# EAGLE design Arduino-Ethernet-Shield2-V2 (EAGLE 6.4)
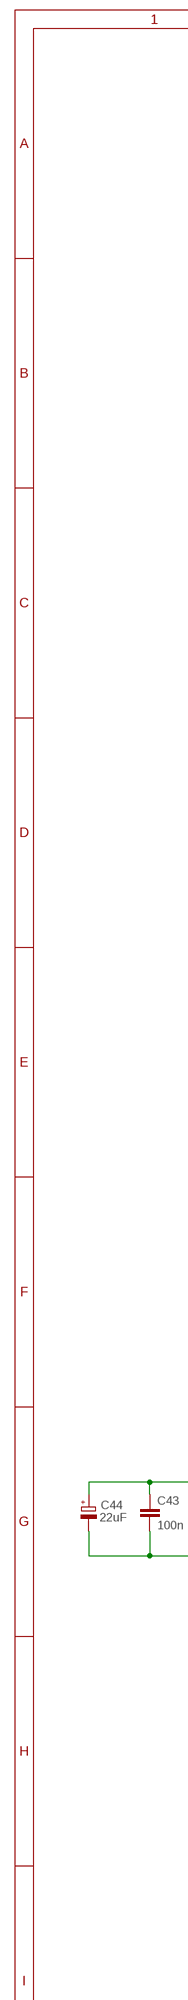
[diagram p0: schematic, sheet 1, part 1 of 2]
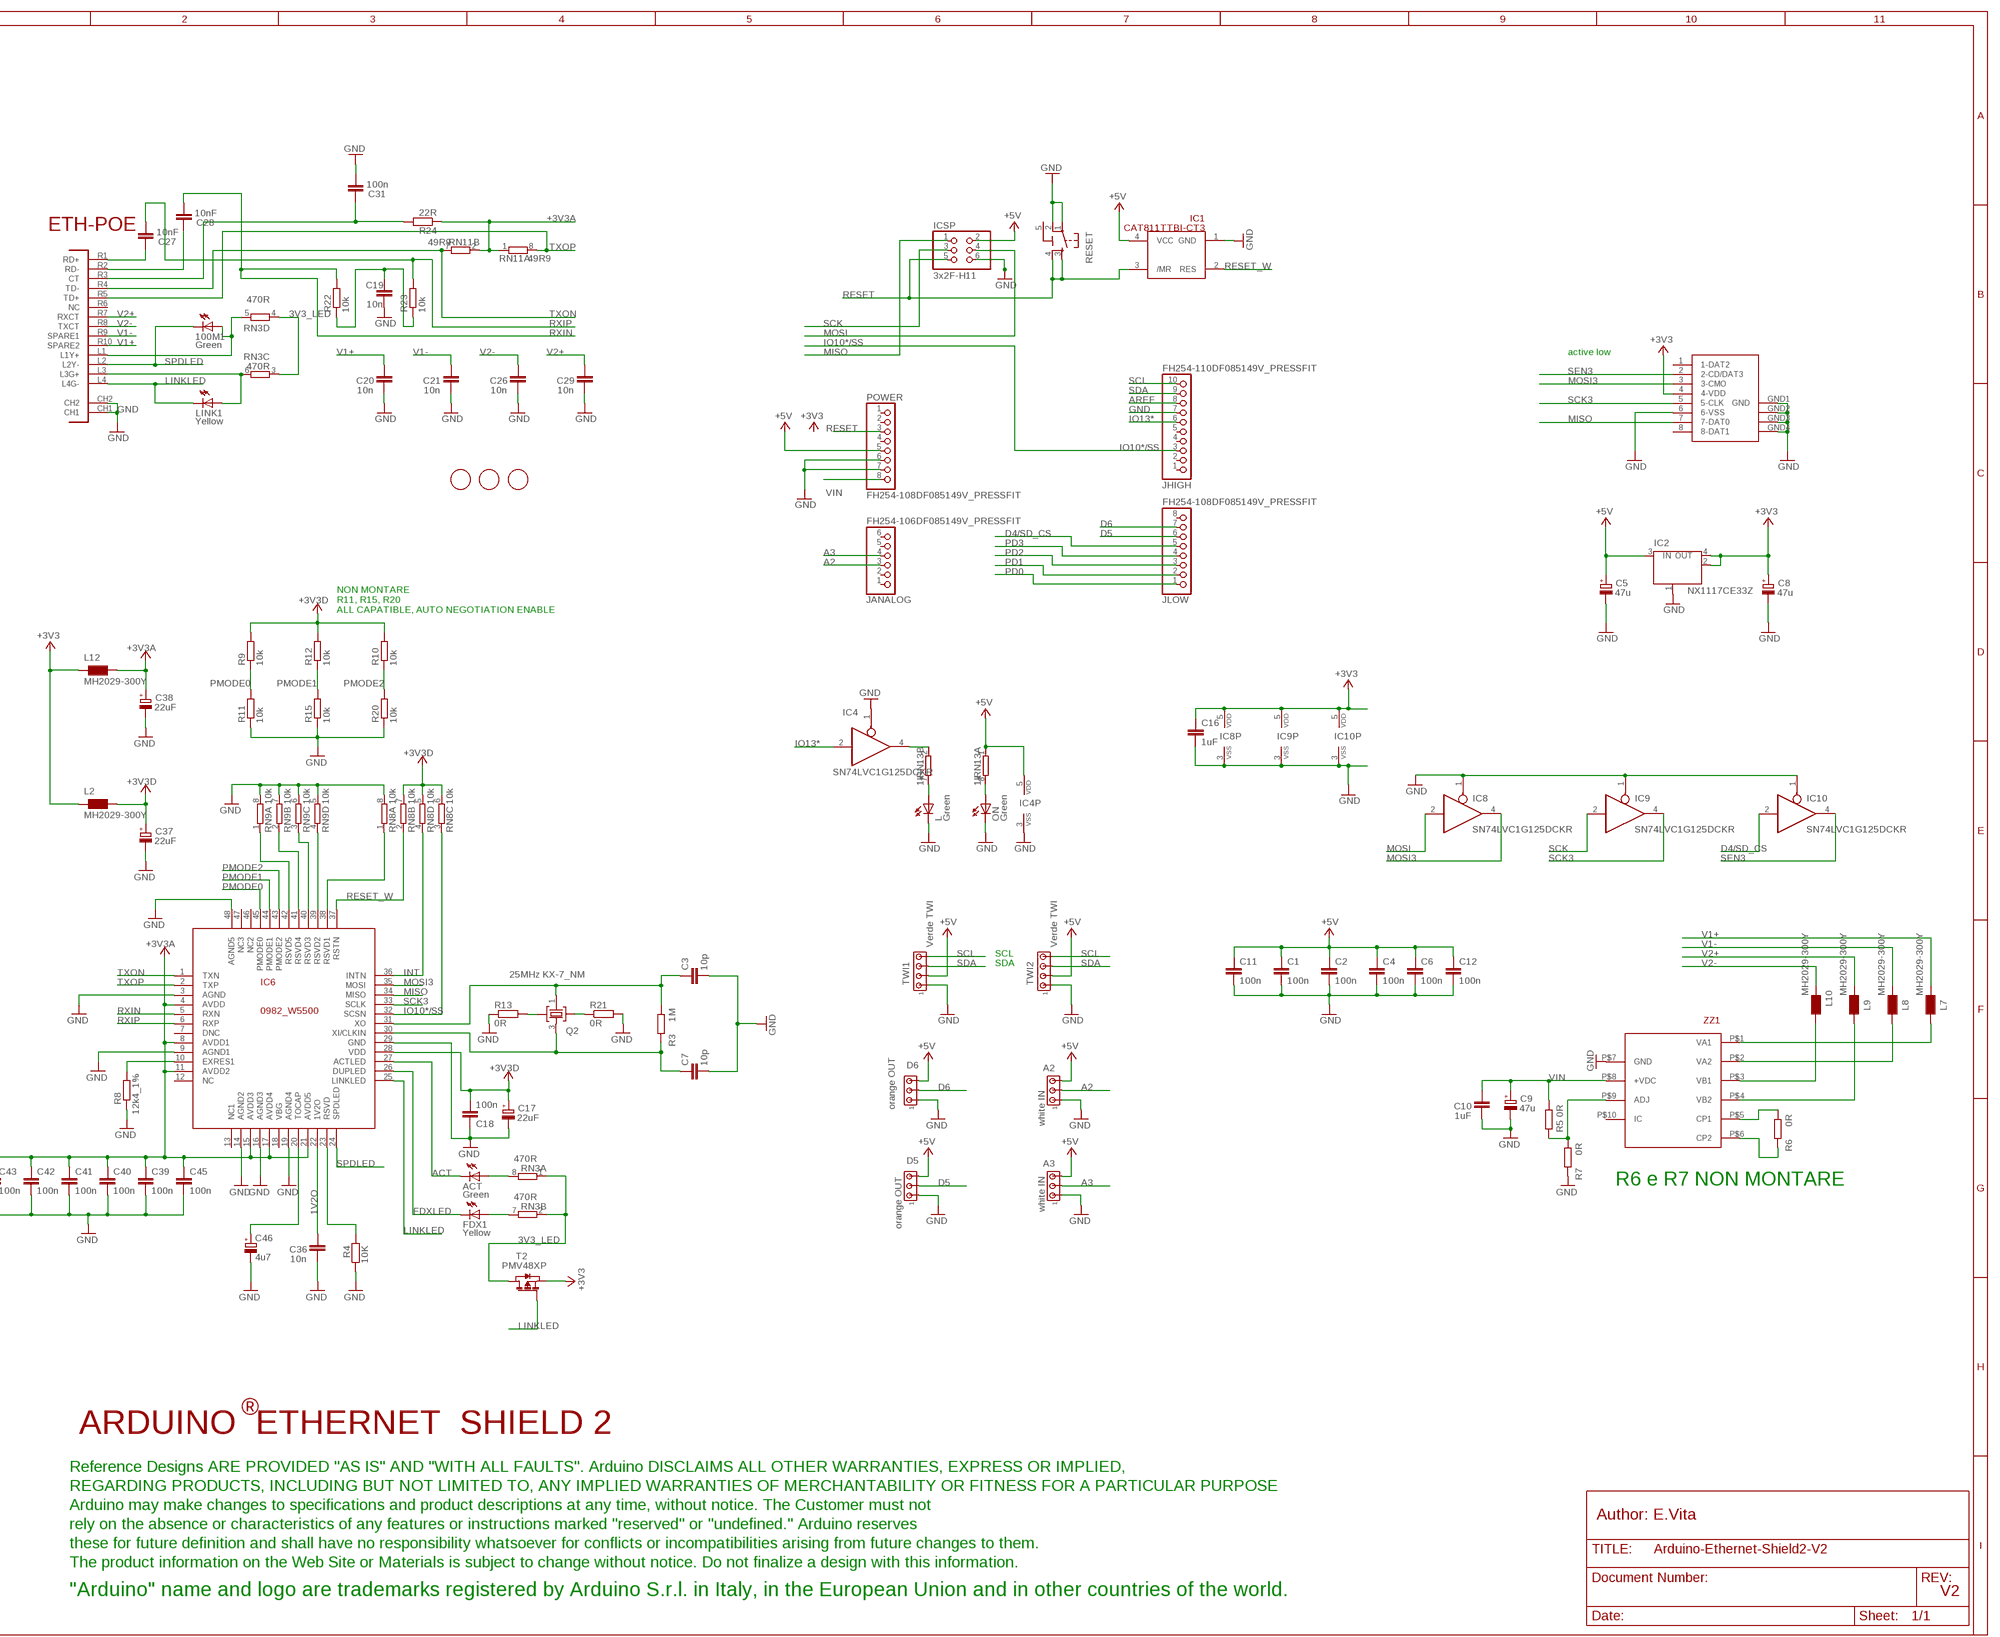
[diagram p1: schematic, sheet 1, part 2 of 2]

## Parts
100M1  Green  0043_KPT-2012SGC  [CHIPLED_0805]
A2  white IN  1695_WA254-03S-IN  [10X03MTA]
A3  white IN  1695_WA254-03S-IN  [10X03MTA]
ACT  Green  0043_KPT-2012SGC  [CHIPLED_0805]
C1  100n  0015_100NF_0603  [C0603-ROUND]
C2  100n  0015_100NF_0603  [C0603-ROUND]
C3  10p  0245_0603C0G10PF50V  [C0603-ROUND]
C4  100n  0015_100NF_0603  [C0603-ROUND]
C5  47u  0113_47UF  [PANASONIC_D]
C6  100n  0015_100NF_0603  [C0603-ROUND]
C7  10p  0245_0603C0G10PF50V  [C0603-ROUND]
C8  47u  0113_47UF  [PANASONIC_D]
C9  47u  0113_47UF  [PANASONIC_D]
C10  1uF  0006_1UF_0603/GRM188R61E105KA12D  [C0603-ROUND]
C11  100n  0015_100NF_0603  [C0603-ROUND]
C12  100n  0015_100NF_0603  [C0603-ROUND]
C16  1uF  0006_1UF_0603/GRM188R61E105KA12D  [C0603-ROUND]
C17  22uF  0167_  [SMC_B]
C18  100n  0015_100NF_0603  [C0603-ROUND]
C19  10n  0142_10NF_0603  [C0603-ROUND]
C20  10n  0142_10NF_0603  [C0603-ROUND]
C21  10n  0142_10NF_0603  [C0603-ROUND]
C26  10n  0142_10NF_0603  [C0603-ROUND]
C27  10nF  0142_10NF_0603  [C0603-ROUND]
C28  10nF  0142_10NF_0603  [C0603-ROUND]
C29  10n  0142_10NF_0603  [C0603-ROUND]
C31  100n  0015_100NF_0603  [C0603-ROUND]
C36  10n  0142_10NF_0603  [C0603-ROUND]
C37  22uF  0167_  [SMC_B]
C38  22uF  0167_  [SMC_B]
C39  100n  0015_100NF_0603  [C0603-ROUND]
C40  100n  0015_100NF_0603  [C0603-ROUND]
C41  100n  0015_100NF_0603  [C0603-ROUND]
C42  100n  0015_100NF_0603  [C0603-ROUND]
C43  100n  0015_100NF_0603  [C0603-ROUND]
C44  22uF  0167_  [SMC_B]
C45  100n  0015_100NF_0603  [C0603-ROUND]
C46  4u7  0474_TAJA475M016RNJ  [SMC_A]
D5  orange OUT  0141_LHA-03-TS  [10X03MTA]
D6  orange OUT  1696_WA254-03S-166  [10X03MTA]
FDX1  Yellow  0044_KPT-2012YC  [CHIPLED_0805]
FID2  FIDUCIALMOUNT  [FIDUCIA-MOUNT]
FID3  FIDUCIALMOUNT  [FIDUCIA-MOUNT]
FID4  FIDUCIALMOUNT  [FIDUCIA-MOUNT]
IC1  CAT811TTBI-CT3  0035_CAT811TTBI-GT3  [SOT143]
IC2  NX1117CE33Z  0045_NX1117CE33Z,115  [SOT223]
IC4  SN74LVC1G125DCKR  0040_SN74LVC1G125DCKR  [SC70-5]
IC6  0982_W5500  [TQFP48-7X7]
IC8  SN74LVC1G125DCKR  0040_SN74LVC1G125DCKR  [SC70-5]
IC9  SN74LVC1G125DCKR  0040_SN74LVC1G125DCKR  [SC70-5]
IC10  SN74LVC1G125DCKR  0040_SN74LVC1G125DCKR  [SC70-5]
ICSP  3x2F-H11  0119_FH254-203DF11000V  [2X03]
JANALOG  FH254-106DF085149V_PRESSFIT  1220_13TW-383/FH254-106DF085149T10PRESSFIT  [1X06-TH-PRESSFIT]
JHIGH  FH254-110DF085149V_PRESSFIT  1219_13TW-386PRESSFIT  [1X10-TH-PRESSFIT]
JLOW  FH254-108DF085149V_PRESSFIT  1221_13TW-384PRESSFIT  [1X08-TH-PRESSFIT]
L  Green  0043_KPT-2012SGC  [CHIPLED_0805]
L2  MH2029-300Y  0001_BLM21PG300SN1D_/_MH2029-300Y  [0805]
L7  MH2029-300Y  0001_BLM21PG300SN1D_/_MH2029-300Y  [0805]
L8  MH2029-300Y  0001_BLM21PG300SN1D_/_MH2029-300Y  [0805]
L9  MH2029-300Y  0001_BLM21PG300SN1D_/_MH2029-300Y  [0805]
L10  MH2029-300Y  0001_BLM21PG300SN1D_/_MH2029-300Y  [0805]
L12  MH2029-300Y  0001_BLM21PG300SN1D_/_MH2029-300Y  [0805]
LINK1  Yellow  0044_KPT-2012YC  [CHIPLED_0805]
ON  Green  0043_KPT-2012SGC  [CHIPLED_0805]
POWER  FH254-108DF085149V_PRESSFIT  1222_13TW-385PRESSFIT  [1X08-TH-PRESSFIT]
Q2  25MHz KX-7_NM  0846_FTX25.000M12SM3S  [CRYSTAL3.2X2.5]
R3  1M  0004_0603_1M  [R0603-ROUND]
R4  10K  0028_CR0603JW103L  [R0603-ROUND]
R5  0R  0233_0R_0603  [R0603-ROUND]
R6  0R  0233_0R_0603  [R0603-ROUND]
R7  0R  0233_0R_0603  [R0603-ROUND]
R8  12k4_1%  0984_12K4_1%_0603  [R0603-ROUND]
R9  10k  0028_CR0603JW103L  [R0603-ROUND]
R10  10k  0028_CR0603JW103L  [R0603-ROUND]
R11  10k  0028_CR0603JW103L  [R0603-ROUND]
R12  10k  0028_CR0603JW103L  [R0603-ROUND]
R13  0R  0039_JUMP_0402  [R0402]
R15  10k  0028_CR0603JW103L  [R0603-ROUND]
R20  10k  0028_CR0603JW103L  [R0603-ROUND]
R21  0R  0039_JUMP_0402  [R0402]
R22  10k  0131_CR0603FX1000L  [R0603-ROUND]
R23  10k  0131_CR0603FX1000L  [R0603-ROUND]
R24  22R  0247_22R_0603  [R0603-ROUND]
RESET  0946_TS42031-160W-TR-7260  [TS42]
RN3  470R  0540_CAY16-471J4LF  [CAY16]
RN8  10k  0016_064R_10K_/_CAY16-103J4LF  [CAY16]
RN9  10k  0016_064R_10K_/_CAY16-103J4LF  [CAY16]
RN11  49R9  0036_CAY16-49R9F4L  [CAY16]
RN13  1k  0005_064R_1K_/_CAY16-102J4LF  [CAY16]
T2  PMV48XP  0297_PMV48XP  [SOT-23]
TWI1  Verde TWI  1693_WA254-04S-632  [10X04MTA]
TWI2  Verde TWI  1693_WA254-04S-632  [10X04MTA]
U$1  DISCLAIMER  [DISCLAIMER]
UC1  RB1-125BHQ1A  0033_RB1-125BHQ1A  [POE-RJ45]
X1  0046_15TW-882  [SDCARD-15TW-8821]
ZZ1  0343_AG9612-2BR  [AG9000]

## Nets
1V2O: C36.2 IC6.22(1V2O)
3V3_LED [power]: RN3.1 RN3.2 RN3.3 RN3.4 T2.1(D)
+3V3 [power]: C8.+ C16.1 IC2.2(OUT) IC2.4(OUT) IC8.5(VDD) IC9.5(VDD) IC10.5(VDD) L2.1 L12.1 T2.2(S) X1.4(4-VDD)
+3V3A [power]: C38.+ C39.1 C40.1 C41.1 C42.1 C43.1 C44.+ C45.1 IC6.4(AVDD) IC6.8(AVDD1) IC6.11(AVDD2) IC6.15(AVDD3) IC6.17(AVDD4) IC6.21(AVDD5) L12.2 R24.1 RN11.1 RN11.2
+3V3D: C17.+ C18.2 C37.+ IC6.28(VDD) L2.2 R9.2 R10.2 R12.2 RN8.5 RN8.6 RN8.7
+5V [power]: A2.3 A3.3 C1.1 C2.1 C4.1 C5.+ C6.1 C11.1 C12.1 D5.3 D6.3 IC1.4(VCC) IC2.3(IN) IC4.5(VDD) ICSP.2 POWER.5 RN13.1 TWI1.2 TWI2.2
A2: A2.2 JANALOG.3
A3: A3.2 JANALOG.4
ACT: ACT.C IC6.27(ACTLED)
AREF: JHIGH.8
D4/SD_CS: IC10.2(I) JLOW.5
D5: D5.2 JLOW.6
D6: D6.2 JLOW.7
FDXLED: FDX1.C IC6.26(DUPLED)
GND [power]: A2.1 A3.1 C1.2 C2.2 C3.2 C4.2 C5.- C6.2 C7.2 C8.- C9.- C10.1 C11.2 C12.2 C16.2 C17.- C18.1 C19.1 C20.1 C21.1 C26.1 C29.1 C31.1 C36.1 C37.- C38.- C39.2 C40.2 C41.2 C42.2 C43.2 C44.- C45.2 C46.- D5.1 D6.1 IC1.1(GND) IC2.1(GND/ADJ) IC4.1(OE) IC4.3(VSS) IC6.3(AGND) IC6.9(AGND1) IC6.14(AGND2) IC6.16(AGND3) IC6.19(AGND4) IC6.29(GND) IC6.48(AGND5) IC8.1(OE) IC8.3(VSS) IC9.1(OE) IC9.3(VSS) IC10.1(OE) IC10.3(VSS) ICSP.6 JHIGH.7 L.C ON.C POWER.6 POWER.7 R4.1 R7.2 R8.1 R11.1 R13.1 R15.1 R20.1 R21.2 RESET.1 RESET.2 RN8.8 RN9.5 RN9.6 RN9.7 RN9.8 TWI1.1 TWI2.1 UC1.CH1 UC1.CH2 X1.6(6-VSS) X1.GND1(GND) X1.GND2(GND1) X1.GND3(GND2) X1.GND4(GND3) ZZ1.P$7(GND)
INT: IC6.36(INTN) RN8.4
IO10*/SS: IC6.32(SCSN) JHIGH.3 RN8.3
IO13*: IC4.2(I) JHIGH.6
LINKLED: IC6.25(LINKLED) LINK1.C T2.3(G) UC1.L4(L4G-)
MISO: IC6.34(MISO) ICSP.1 X1.7(7-DAT0)
MOSI: IC8.2(I) ICSP.4
MOSI3: IC6.35(MOSI) IC8.4(O) X1.3(3-CMO)
N$1: L7.2 ZZ1.P$1(VA1)
N$2: L8.2 ZZ1.P$2(VA2)
N$3: L9.2 ZZ1.P$4(VB2)
N$4: L10.2 ZZ1.P$3(VB1)
N$9: C3.1 IC6.31(XO) Q2.1 R3.1
N$13: IC6.39(RSVD2) RN9.4
N$14: ACT.A RN3.8
N$15: Q2.2 R13.2
N$16: Q2.4 R21.1
N$22: LINK1.A RN3.6 UC1.L3(L3G+)
N$24: IC6.23(RSVD) R4.2
N$25: 100M1.A RN3.5 UC1.L1(L1Y+)
N$26: C19.2 R22.1 R23.1
N$27: C27.2 UC1.R1(RD+)
N$28: C28.2 UC1.R2(RD-)
N$30: FDX1.A RN3.7
N$31: IC6.40(RSVD3) RN9.3
N$32: R6.1 ZZ1.P$5(CP1)
N$33: R6.2 ZZ1.P$6(CP2)
N$34: R5.2 R7.1 ZZ1.P$9(ADJ)
N$35: IC6.41(RSVD4) RN9.2
N$36 [power]: C31.2 R24.2 UC1.R3(CT)
N$37: IC6.42(RSVD5) RN9.1
N$38: C46.+ IC6.20(TOCAP)
N$39: IC6.38(RSVD1) RN8.1
N$40: IC6.10(EXRES1) R8.2
N$41: ON.A RN13.8
N$42: IC4.4(O) RN13.2
N$43: L.A RN13.7
OSC2E2: C7.1 IC6.30(XI/CLKIN) Q2.3 R3.2
PD0: JLOW.1
PD1: JLOW.2
PD2: JLOW.3
PD3: JLOW.4
PMODE0: IC6.45(PMODE0) R9.1 R11.2
PMODE1: IC6.44(PMODE1) R12.1 R15.2
PMODE2: IC6.43(PMODE2) R10.1 R20.2
RESET: IC1.3(/MR) ICSP.5 POWER.3 RESET.3 RESET.4
RESET_W: IC1.2(RES) IC6.37(RSTN) RN8.2
RXIN: C28.1 IC6.5(RXN) R22.2
RXIP: C27.1 IC6.6(RXP) R23.2
SCK: IC9.2(I) ICSP.3
SCK3: IC6.33(SCLK) IC9.4(O) X1.5(5-CLK)
SCL: JHIGH.10 TWI1.4 TWI2.4
SDA: JHIGH.9 TWI1.3 TWI2.3
SEN3: IC10.4(O) X1.2(2-CD/DAT3)
SPDLED: 100M1.C IC6.24(SPDLED) UC1.L2(L2Y-)
TXON: IC6.1(TXN) RN11.7 UC1.R4(TD-)
TXOP: IC6.2(TXP) RN11.8 UC1.R5(TD+)
V1+ [gnd]: C20.2 L7.1 UC1.R10(SPARE2)
V1- [gnd]: C21.2 L8.1 UC1.R9(SPARE1)
V2+ [gnd]: C29.2 L9.1 UC1.R7(RXCT)
V2- [gnd]: C26.2 L10.1 UC1.R8(TXCT)
VIN [gnd]: C9.+ C10.2 POWER.8 R5.1 ZZ1.P$8(+VDC)
Unconnected: IC6.7(DNC) IC6.13(NC1) IC6.18(VBG) IC6.46(NC2) IC6.47(NC3) JANALOG.1 JANALOG.2 JANALOG.5 JANALOG.6 JHIGH.1 JHIGH.2 JHIGH.4 JHIGH.5 JLOW.8 POWER.1 POWER.2 POWER.4 RN11.3 RN11.4 RN11.5 RN11.6 RN13.3 RN13.4 RN13.5 RN13.6 UC1.R6(NC) X1.1(1-DAT2) X1.8(8-DAT1) ZZ1.P$10(IC)

## Notes on the sheet
- ETH-POE
- active low
- NON MONTARE
  R11, R15, R20
  ALL CAPATIBLE, AUTO NEGOTIATION ENABLE
- SCL
- SDA
- R6 e R7 NON MONTARE
- ®
- ARDUINO  ETHERNET  SHIELD 2
- Author: E.Vita
- V2

## Power pins joined to a net without a drawn wire
5-GND: RESET.5(5-GND)
NC: IC6.12(NC)

## Library data of the parts
100M1 ACT L ON = Opto:0043_KPT-2012SGC: LED GREEN - SMD-0805; MONTHLY_USAGE: _____; PART_NUMBER: KPT-2012SGC; PRICE: _____; SUPPLIER: _____; TYPE: Opto
A2 A3 = Connettori:1695_WA254-03S-IN: 3x1 V Bianco P2,54 Serigrafati IN; MONTHLY_USAGE: _____; PART_NUMBER: WA254-03S-IN; PRICE: _____; SUPPLIER: _____; TYPE: Connettori; VALUE: WA254-03S-IN
C1 C2 C4 C6 C11 C12 C18 C31 C39-C43 C45 = Condensatori:0015_100NF_0603: 100nF 0603 50V; CASE: 0603; MONTHLY_USAGE: _____; PART_NUMBER: cl10b104kbnc; PRICE: _____; SUPPLIER: _____; TYPE: Condensatori; VALUE: 100nF
C3 C7 = Condensatori:0245_0603C0G10PF50V: 10pF 0603; CASE: 0603; MONTHLY_USAGE: _____; PART_NUMBER: 0603C0G10PF50V; PRICE: _____; SUPPLIER: _____; TYPE: Condensatori; VALUE: 10pF
C5 C8 C9 = Condensatori:0113_47UF: 47uF; MONTHLY_USAGE: _____; PART_NUMBER: 47uF; PRICE: _____; SUPPLIER: _____; TYPE: Condensatori; VALUE: 47uF
C10 C16 = Condensatori:0006_1UF_0603/GRM188R61E105KA12D: 1uF 0603; CASE: 0603; MONTHLY_USAGE: 207014.16; PART_NUMBER: 1uF_0603/GRM188R61E105KA12D; PRICE: �_0.00; SUPPLIER: La_Tecnika_Due_s.r.l.; TYPE: Condensatori
C17 C37 C38 C44 = Condensatori:0167_: 22uF 25V; MONTHLY_USAGE: _____; PRICE: _____; SUPPLIER: _____; TYPE: Condensatori
C19-C21 C26 C29 C36 = Condensatori:0142_10NF_0603: 10nF 0603; CASE: 0603; MONTHLY_USAGE: _____; PART_NUMBER: 10nF_0603; PRICE: _____; SUPPLIER: _____; TYPE: Condensatori; VALUE: 10nF
C27 C28 = Condensatori:0142_10NF_0603: 10nF 0603; CASE: 0603; MONTHLY_USAGE: _____; PART_NUMBER: 10nF_0603; PRICE: _____; SUPPLIER: _____; TYPE: Condensatori
C46 = Condensatori:0474_TAJA475M016RNJ: 4u7 tantalio Case A - testa gialla -Tantalio; CASE: CaseA_(1206); MONTHLY_USAGE: _____; PART_NUMBER: TAJA475M016RNJ; PRICE: _____; SUPPLIER: _____; TYPE: Condensatori
D5 = Connettori:0141_LHA-03-TS: 3x1 V Bianco P2,54; MONTHLY_USAGE: _____; PART_NUMBER: LHA-03-TS; PRICE: _____; SUPPLIER: _____; TYPE: Connettori; VALUE: LHA-03-TS
D6 = Connettori:1696_WA254-03S-166: 3x1 Poli V Arancioni Serigrafati OUT; MONTHLY_USAGE: _____; PART_NUMBER: WA254-03S-166; PRICE: _____; SUPPLIER: _____; TYPE: Connettori; VALUE: WA254-03S-166
FDX1 LINK1 = Opto:0044_KPT-2012YC: LED YELLOW - SMD - 0805; MONTHLY_USAGE: _____; PART_NUMBER: KPT-2012YC; PRICE: _____; SUPPLIER: _____; TYPE: Opto
FID2-FID4 = SmartPrj:FIDUCIALMOUNT
IC1 = Circuito Integrato:0035_CAT811TTBI-GT3: 4-Pin Microprocessor Power Supply Supervisors- Reset Controller CAT811TTBI-GT3; CASE: SOT143-4; MONTHLY_USAGE: 10756.97; PART_NUMBER: CAT811TTBI-GT3; PRICE: _0.15; SUPPLIER: La_Tecnika_Due_s.r.l.; TYPE: Circuito_Integrato; VALUE: CAT811TTBI-GT3
IC2 = Circuito Integrato:0045_NX1117CE33Z,115: Low-dropout linear regulator 3V3 NX1117CE33Z,115; CASE: SOT223; MONTHLY_USAGE: 11235.06; PART_NUMBER: NX1117CE33Z,115; PRICE: _0.05; SUPPLIER: EBV_Elektronik_Srl; TYPE: Circuito_Integrato
IC4 IC8-IC10 = Circuito Integrato:0040_SN74LVC1G125DCKR: Single bus buffer with 3-state output; CASE: SC70; MONTHLY_USAGE: _____; PART_NUMBER: SN74LVC1G125DCKR; PRICE: _____; SUPPLIER: _____; TYPE: Circuito_Integrato; VALUE: 74LVC1G125DCKR
IC6 = Circuito Integrato:0982_W5500: The W5500 chip is a Hardwired TCP/IP embedded Ethernet controller that enables easier internet connection for embedded systems using SPI (Serial Peripheral Interface). Case TQFP48; PART_NUMBER: W5500
ICSP = Connettori:0119_FH254-203DF11000V: 3x2 F p2,54 h 11 mm; PART_NUMBER: FH254-203DF11000V; TYPE: Connettori; VALUE: FH254-203DF11000V
JANALOG = Connettori:1220_13TW-383/FH254-106DF085149T10: Female Connector strip for Arduino Shields - 6x1 F V h 14,9 P2,54 serigrafato ANALOG IN; PART_NUMBER: FH254-106DF085149T10; TYPE: Connettori; VALUE: FH254-106DF085149T10_PRESSFIT
JHIGH = Connettori:1219_13TW-386: Female Connector strip for Arduino Shields - 10x1 F V h 14,9 P2,54 serigrafato STRISCIA VUOTA; PART_NUMBER: 13TW-386; TYPE: Connettori; VALUE: 13TW-386_PRESSFIT
JLOW = Connettori:1221_13TW-384: Female Connector strip for Arduino Shields - 8x1 F V h 14,9 P2,54 serigrafato DIGITAL; PART_NUMBER: 13TW-384; TYPE: Connettori; VALUE: 13TW-384_PRESSFIT
L2 L7-L10 L12 = Protezione:0001_BLM21PG300SN1D_/_MH2029-300Y: BLM21; MONTHLY_USAGE: _____; PART_NUMBER: BLM21PG300SN1D_/_MH2029-300Y; PRICE: _____; SUPPLIER: _____; TYPE: Protezione
POWER = Connettori:1222_13TW-385: Female Connector strip for Arduino Shields - 8x1 F V h 14,9 P2,54 serigrafato POWER; PART_NUMBER: 13TW-384; TYPE: Connettori; VALUE: 13TW-384_PRESSFIT
Q2 = Cristalli:0846_FTX25.000M12SM3S: 25Mhz - K7 12pF - SMD; MONTHLY_USAGE: _____; PART_NUMBER: FTX25.000M12SM3S; PRICE: _____; SUPPLIER: _____; TYPE: Cristalli; VALUE: FTX25.000M12SM3S
R3 = Resistenze:0004_0603_1M: 1M 0603; CASE: 0603; MONTHLY_USAGE: _____; PART_NUMBER: 0603_1M; PRICE: _____; SUPPLIER: _____; TYPE: Resistenze
R4 = Resistenze:0028_CR0603JW103L: 10K 0603; CASE: 0603; MONTHLY_USAGE: _____; PART_NUMBER: CR0603JW103L; PRICE: _____; SUPPLIER: _____; TYPE: Resistenze; VALUE: 10k
R5-R7 = Resistenze:0233_0R_0603: 0R 0603; CASE: 0603; MONTHLY_USAGE: _____; PART_NUMBER: 0R_0603; PRICE: _____; SUPPLIER: _____; TYPE: Resistenze
R8 = Resistenze:0984_12K4_1%_0603: 12K4 1% 0603; CASE: 0603; MONTHLY_USAGE: _____; PART_NUMBER: 12K4_1%_0603; PRICE: _____; SUPPLIER: _____; TYPE: Resistenze
R9-R12 R15 R20 = Resistenze:0028_CR0603JW103L: 10K 0603; CASE: 0603; MONTHLY_USAGE: _____; PART_NUMBER: CR0603JW103L; PRICE: _____; SUPPLIER: _____; TYPE: Resistenze
R13 R21 = Resistenze:0039_JUMP_0402: 0R 0402; CASE: 0402; MONTHLY_USAGE: _____; PART_NUMBER: JUMP_0402; PRICE: _____; SUPPLIER: _____; TYPE: Resistenze
R22 R23 = Resistenze:0131_CR0603FX1000L: 100R 0805; CASE: 0603; PART_NUMBER: CR0603FX1000L; TYPE: Resistenze; VALUE: 100R
R24 = Resistenze:0247_22R_0603: 22R 0603; CASE: 0603; MONTHLY_USAGE: _____; PART_NUMBER: 22R_0603; PRICE: _____; SUPPLIER: _____; TYPE: Resistenze
RESET = Switches:0946_TS42031-160W-TR-7260: Pushbutton 6x6 Smd - White; MONTHLY_USAGE: _____; PART_NUMBER: IT-1157AHNP-160G-G_GTR; PRICE: _____; SUPPLIER: _____; TYPE: Switches; VALUE: TS42
RN3 = Resistenze:0540_CAY16-471J4LF: 470R 064R; CASE: SMD_3,2x1,6; MONTHLY_USAGE: _____; PART_NUMBER: CAY16-471J4LF; PRICE: _____; SUPPLIER: _____; TYPE: Resistenze; VALUE: 470R_064R
RN8 RN9 = Resistenze:0016_064R_10K_/_CAY16-103J4LF: 10K 064 R; CASE: SMD_3,2x1,6; MONTHLY_USAGE: _____; PART_NUMBER: 064R_10K_/_CAY16-103J4LF; PRICE: _____; SUPPLIER: _____; TYPE: Resistenze
RN11 = Resistenze:0036_CAY16-49R9F4L: 49R9; CASE: SMD_3,2x1,6; MONTHLY_USAGE: _____; PART_NUMBER: CAY16-49R9F4L; PRICE: _____; SUPPLIER: _____; TYPE: Resistenze
RN13 = Resistenze:0005_064R_1K_/_CAY16-102J4LF: 1K 064R; CASE: SMD_3,2x1,6; MONTHLY_USAGE: _____; PART_NUMBER: 064R_1K_/_CAY16-102J4LF; PRICE: _____; SUPPLIER: _____; TYPE: Resistenze; VALUE: 1K
T2 = Transistors:0297_PMV48XP: 20 V, 3.5 A P-channel Trench MOSFET - PMV48XP; CASE: SOT23; MONTHLY_USAGE: _____; PART_NUMBER: PMV48XP; PRICE: _____; SUPPLIER: _____; TYPE: Transistor
TWI1 TWI2 = Connettori:1693_WA254-04S-632: 4x1 V Verde p 2,54 Serigrafato TWI; MONTHLY_USAGE: _____; PART_NUMBER: WA254-04S-632; PRICE: _____; SUPPLIER: _____; TYPE: Connettori; VALUE: WA254-04S-632
U$1 = Misc:DISCLAIMER
UC1 = Connettori:0033_RB1-125BHQ1A: RB1-125BHQ1A; MONTHLY_USAGE: _____; PART_NUMBER: RB1-125BHQ1A; PRICE: _____; SUPPLIER: _____; TYPE: Connettori
X1 = Connettori:0046_15TW-882: SD CARD MICRO SMD-15TW-15882; MONTHLY_USAGE: 9256.37; PART_NUMBER: 15TW-882 REEL; PRICE: 0.52; SUPPLIER: La_Tecnika_Due_s.r.l.; TYPE: Connettori; VALUE: SDCARD-15TW-882
ZZ1 = Moduli:0343_AG9612-2BR: Poe module AG9612-2BR, 12V, isolato; MONTHLY_USAGE: 1889.81; PART_NUMBER: AG9612-2BR; PRICE: �_4.16; SUPPLIER: Celte_Srl; TYPE: Moduli; VALUE: AG9612-2BR

## Net classes
1 power: width 0.254 mm, drill 0.61 mm, clearance 0.203 mm
2 gnd: width 0.254 mm, drill 0.584 mm, clearance 0.254 mm

## Board
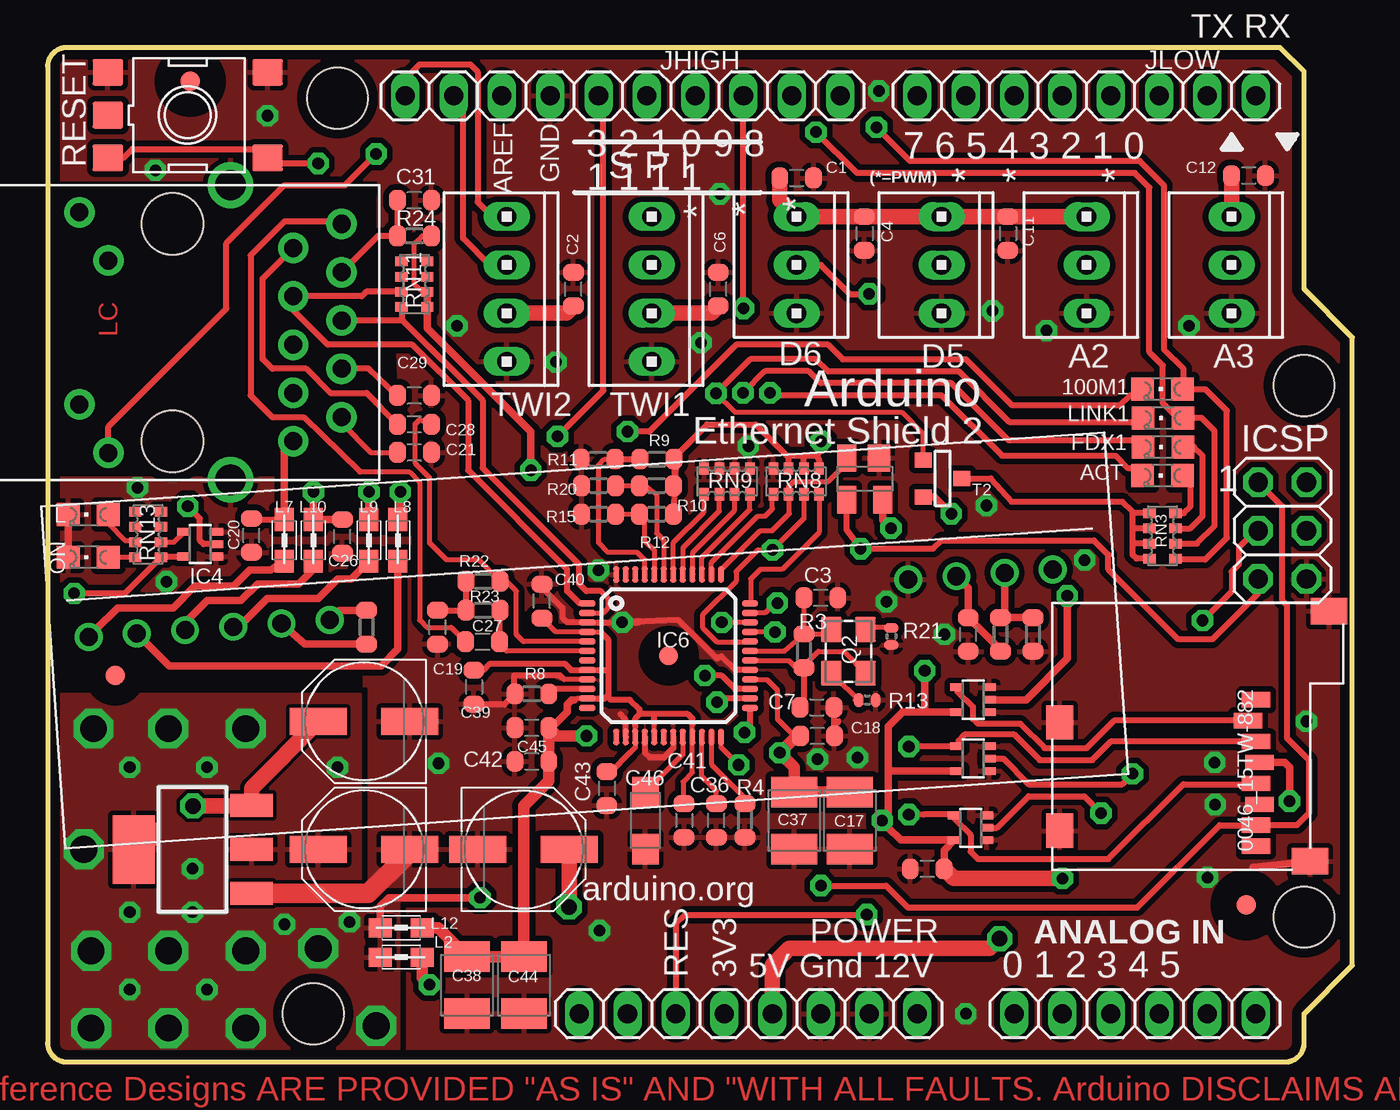
[diagram p2: board, top side]
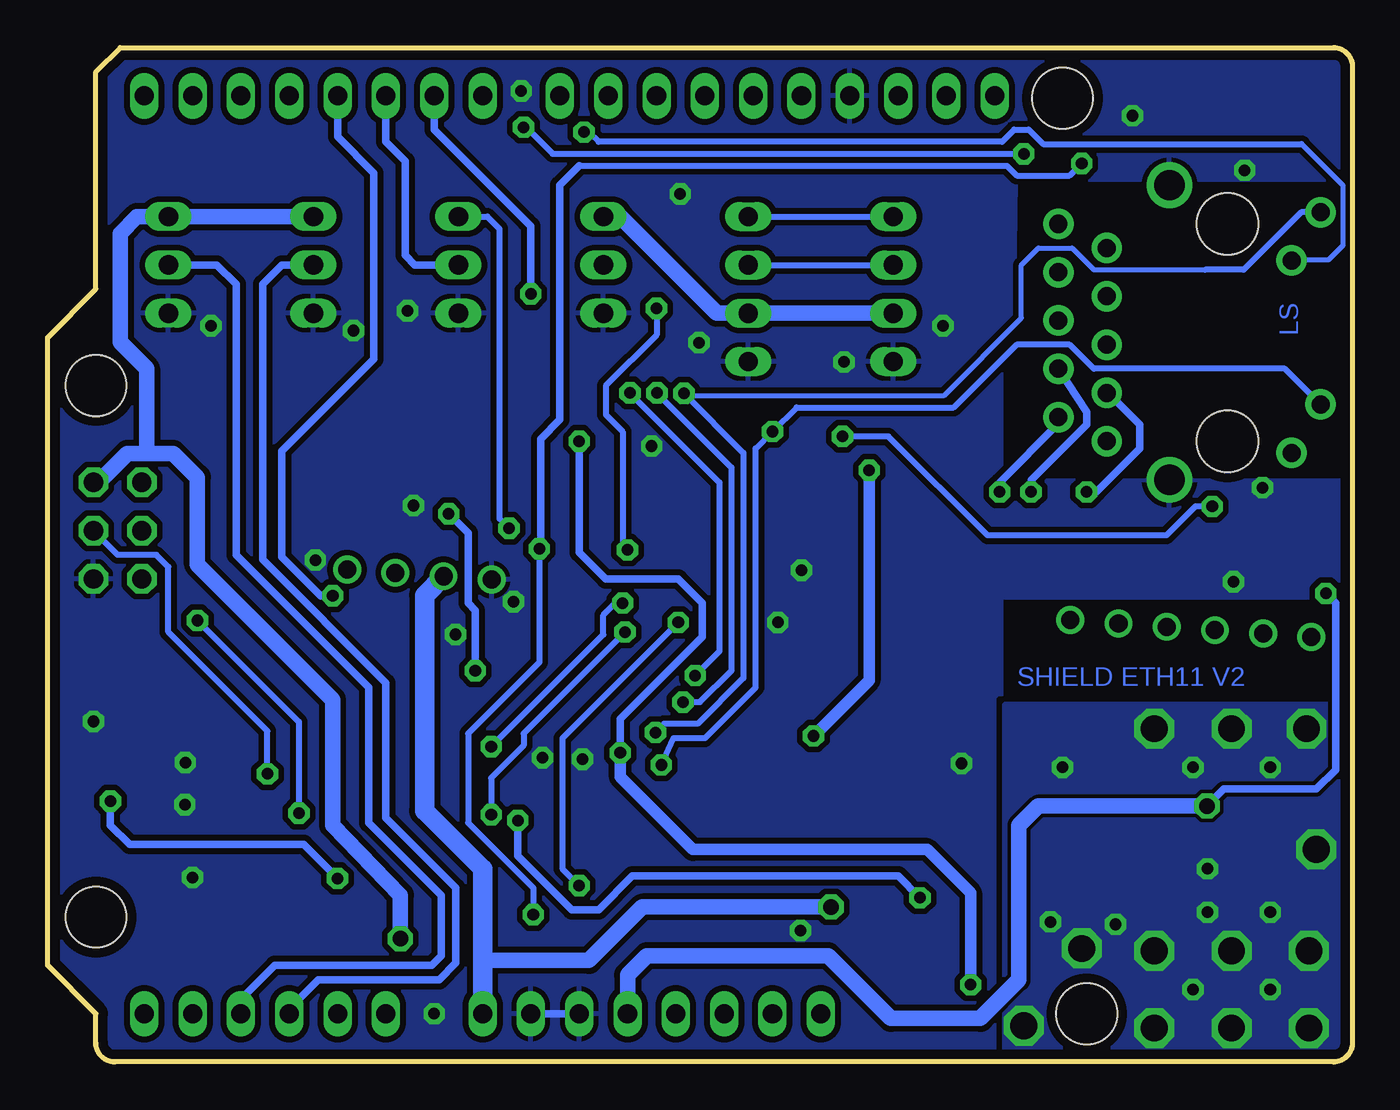
[diagram p3: board, bottom side, seen from below]

Size 68.58 x 53.34 mm. Coordinates in mm from the lower left corner, seen from the top.
Outline: 66.04,2.54 68.58,5.08 68.58,38.1 66.04,40.64 66.04,52.07 64.77,53.34 1,53.34 arc90 0,52.34 0,1 arc90 1,0 65.04,0 arc90 66.04,1 66.04,2.54
Copper layers (1*16): Top 0.035mm / dielectric 1.5mm / Bottom 0.035mm
Design rules "default *": minimum track width 10mil, minimum drill 24mil, track to track 8mil, track to pad 8mil, pad to pad 8mil, via to via 8mil, smd to smd 6mil, copper to edge 20mil, drill to drill 10mil, minimum pad ring 10mil, minimum via ring 10mil, stop-mask expansion 2mil, vias tented up to drill 32mil, thermal gap 10mil
Holes 3.2 mm at 66.04,35.56 66.04,7.62 15.24,50.67 13.97,2.54

### Footprints (pad centres in the part's own frame; a part is rotated, then mirrored left to right if it is on the bottom)
CHIPLED_0805 = smd 1.2 x 1.2: A 0,-1.05; C 0,1.05
10X03MTA = drill 1.016 long: 1 2.54,0; 2 0,0; 3 -2.54,0
C0603-ROUND = smd 0.898 x 1.1: 1 -0.889,0; 2 0.889,0
PANASONIC_D = smd 3 x 1.4: + 2.4,0; - -2.4,0
SMC_B = smd 1.6 x 2.4: + -1.5,0; - 1.5,0
SMC_A = smd 1.6 x 1.4: + -1.5,0; - 1.5,0
FIDUCIA-MOUNT = smd 1.016 x 1.016: P$1 0,0
SOT143 = smd 1.2 x 1.44: 1 -0.75,-1.1 | smd 1 x 1.44: 2 0.95,-1.1; 3 0.95,1.1; 4 -0.95,1.1
SOT223 = smd 1.219 x 2.235: 1 -2.311,-3.099; 2 0,-3.099; 3 2.311,-3.099 | smd 3.6 x 2.2: 4 0,3.099
SC70-5 = smd 0.4 x 0.7: 1 -0.65,-0.85; 2 0,-0.85; 3 0.65,-0.85; 4 0.65,0.85; 5 -0.65,0.85
TQFP48-7X7 = smd 0.85 x 0.32: 1 -4.275,2.75; 2 -4.275,2.25; 3 -4.275,1.75; 4 -4.275,1.25; 5 -4.275,0.75; 6 -4.275,0.25; 7 -4.275,-0.25; 8 -4.275,-0.75; 9 -4.275,-1.25; 10 -4.275,-1.75; 11 -4.275,-2.25; 12 -4.275,-2.75; 25 4.275,-2.75; 26 4.275,-2.25; 27 4.275,-1.75; 28 4.275,-1.25; 29 4.275,-0.75; 30 4.275,-0.25; 31 4.275,0.25; 32 4.275,0.75; 33 4.275,1.25; 34 4.275,1.75; 35 4.275,2.25; 36 4.275,2.75 | smd 0.32 x 0.85: 13 -2.75,-4.275; 14 -2.25,-4.275; 15 -1.75,-4.275; 16 -1.25,-4.275; 17 -0.75,-4.275; 18 -0.25,-4.275; 19 0.25,-4.275; 20 0.75,-4.275; 21 1.25,-4.275; 22 1.75,-4.275; 23 2.25,-4.275; 24 2.75,-4.275; 37 2.75,4.275; 38 2.25,4.275; 39 1.75,4.275; 40 1.25,4.275; 41 0.75,4.275; 42 0.25,4.275; 43 -0.25,4.275; 44 -0.75,4.275; 45 -1.25,4.275; 46 -1.75,4.275; 47 -2.25,4.275; 48 -2.75,4.275 | smd 1 x 1: P$1 0,0
2X03 = drill 1.016 pad 1.55 octagon: 1 -2.54,-1.27; 2 -2.54,1.27; 3 0,-1.27; 4 0,1.27; 5 2.54,-1.27; 6 2.54,1.27
1X06-TH-PRESSFIT = drill 1 pad 1.422 long: 1 -6.35,0; 2 -3.81,0; 3 -1.27,0; 4 1.27,0; 5 3.81,0; 6 6.35,0
1X10-TH-PRESSFIT = drill 1 pad 1.422 long: 1 -11.43,0; 2 -8.89,0; 3 -6.35,0; 4 -3.81,0; 5 -1.27,0; 6 1.27,0; 7 3.81,0; 8 6.35,0; 9 8.89,0; 10 11.43,0
1X08-TH-PRESSFIT = drill 1 pad 1.422 long: 1 -8.89,0; 2 -6.35,0; 3 -3.81,0; 4 -1.27,0; 5 1.27,0; 6 3.81,0; 7 6.35,0; 8 8.89,0
0805 = smd 1.2 x 1: 1 -1.1,0; 2 1.1,0
CRYSTAL3.2X2.5 = smd 1.3 x 1.1: 1 -1.15,-0.9; 2 1.15,-0.9; 3 1.15,0.9; 4 -1.15,0.9
R0603-ROUND = smd 0.898 x 1.1: 1 -0.889,0; 2 0.889,0
R0402 = smd 0.508 x 0.762: 1 -0.445,0; 2 0.445,0
TS42 = smd 1.6 x 1.4: 1 -4.2,2.25; 2 4.2,2.25; 3 -4.2,-2.25; 4 4.2,-2.25; 5 -4.2,0
CAY16 = smd 0.5 x 0.65: 1 -1.2,-0.675; 2 -0.4,-0.675; 3 0.4,-0.675; 4 1.2,-0.675; 5 1.2,0.675; 6 0.4,0.675; 7 -0.4,0.675; 8 -1.2,0.675
SOT-23 = smd 0.787 x 0.889: 1 0.025,-1.016; 2 -0.94,1.016; 3 0.991,1.016
10X04MTA = drill 1.016 long: 1 3.81,0; 2 1.27,0; 3 -1.27,0; 4 -3.81,0
POE-RJ45 = drill 1.6: CH1 13.94,7.75; CH2 13.94,-7.75 | drill 0.95 pad 1.6: L1 7.51,-6.325; L2 5.99,-3.785; L3 7.51,3.785; L4 5.99,6.325; R1 19.77,5.715; R2 17.23,4.445; R3 19.77,3.175; R4 17.23,1.905; R5 19.77,0.635; R6 17.23,-0.635; R7 19.77,-1.905; R8 17.23,-3.175; R9 19.77,-4.445; R10 17.23,-5.715 | hole 3.25: 10.89,5.715; 10.89,-5.715
SDCARD-15TW-8821 = smd 0.8 x 1.5: 1 0,0; 2 1.1,-0.4; 3 2.2,0; 4 3.3,0.2; 5 4.4,0; 6 5.5,0.2; 7 6.6,0; 8 7.7,0 | smd 1.4 x 1.9: GND1 -4.66,3.85; GND2 8.49,2.85 | smd 1.8 x 1.4: GND3 1.19,-10.3; GND4 6.89,-10.3
AG9000 = drill 0.95 pad 1.422: P$1 0,0; P$2 2.54,0; P$3 5.08,0; P$4 7.62,0; P$5 10.16,0; P$6 12.7,0; P$7 43.18,0; P$8 45.72,0; P$9 48.26,0; P$10 50.8,0

### Placement (x,y rotation side)
100M1  58.6,35.38 90 top
A2  54.61,41.91 270 top
A3  62.23,41.91 270 top
ACT  58.6,30.84 90 top
C1  39.37,46.48 0 top
C2  27.64,40.64 90 top
C3  40.64,24.41 0 top
C4  42.93,43.56 270 top
C5  16.64,17.91 180 top
C6  35.26,40.64 90 top
C7  40.44,18.64 0 top
C8  16.64,11.18 180 top
C9  25.02,11.18 0 top
C10  48.39,22.48 90 top
C11  50.47,43.56 270 top
C12  63.12,46.61 0 top
C16  46.23,10.16 180 top
C17  42.16,12.7 270 top
C18  40.46,17.14 180 top
C19  20.5,22.86 90 top
C20  10.72,27.69 90 top
C21  19.28,32.05 180 top
C26  15.49,27.64 90 top
C27  22.86,22.1 180 top
C28  19.28,33.53 180 top
C29  19.28,35.05 180 top
C31  19.28,45.31 180 top
C36  35.15,12.7 90 top
C37  39.24,12.7 270 top
C38  22.05,4.04 270 top
C39  22.4,19.71 270 top
C40  25.98,24.23 90 top
C41  33.45,12.7 270 top
C42  25.45,15.8 180 top
C43  29.39,14.38 270 top
C44  25.04,4.04 270 top
C45  25.45,17.58 180 top
C46  31.42,12.7 270 top
D5  46.99,41.91 270 top
D6  39.37,41.91 270 top
FDX1  58.62,32.33 90 top
FID2  62.99,8.26 0 top
FID3  7.49,51.56 0 top
FID4  3.56,20.32 0 top
IC1  42.95,30.66 180 top
IC2  7.62,11.18 90 top
IC4  8.03,27.23 90 top
IC6  32.64,21.36 0 top
IC8  48.64,15.95 90 top
IC9  48.51,12.32 90 top
IC10  48.64,19.05 90 top
ICSP  64.9,27.94 270 top
JANALOG  57.15,2.54 0 top
JHIGH  30.23,50.8 180 top
JLOW  54.61,50.8 180 top
L  2.13,28.78 90 top
L2  18.59,5.51 0 top
L7  12.45,27.43 270 top
L8  18.41,27.43 270 top
L9  16.89,27.43 270 top
L10  13.97,27.43 270 top
L12  18.59,7.06 0 top
LINK1  58.62,33.86 90 top
ON  2.13,26.54 90 top
POWER  36.83,2.54 0 top
Q2  42.09,21.59 270 top
R3  39.75,21.62 270 top
R4  36.65,12.7 90 top
R5  50.09,22.48 90 top
R6  16.76,22.86 90 top
R7  51.79,22.48 270 top
R8  25.45,19.35 0 top
R9  32.03,31.7 0 top
R10  32,30.3 0 top
R11  28.93,31.7 0 top
R12  32,28.8 0 top
R13  43.08,19.02 180 top
R15  28.96,28.8 0 top
R20  28.96,30.3 0 top
R21  44.35,22.38 270 top
R22  22.89,25.27 0 top
R23  22.89,23.75 0 top
R24  19.28,43.43 180 top
RESET  7.37,49.78 0 top
RN3  58.6,27.66 270 top
RN8  39.34,30.53 0 top
RN9  35.71,30.53 0 top
RN11  19.28,40.89 90 top
RN13  5.28,27.74 90 top
T2  47.04,30.66 90 top
TWI1  31.75,40.64 270 top
TWI2  24.13,40.64 270 top
U$1  -4.83,-20.19 0 top  (outside the outline)
UC1  -4.32,38.35 0 top
X1  63.5,19.05 270 top
ZZ1  2.16,22.35 4 top

### Tracks (layer width: path | path; a pad name or v marks a point on that pad's centre or on a via)
1V2O
  Top 0.254: C36.2 35.15,14.25 34.39,15.01 IC6.22
3V3_LED
  Top 0.305: T2.1 49.58,30.68 50.67,29.46 56.49,29.46 57.02,28.93 57.02,28.83 | RN3.4 57.23,26.46 57.02,26.67 57.02,27.3 | 57.02,27.3 57.02,28.07 | 57.02,28.07 57.02,28.83 | RN3.1 57.05,28.86 57.02,28.83 | RN3.2 57.03,28.06 57.02,28.07 | RN3.3 57.07,27.26 57.02,27.3
+3V3  (via drill 0.61, 1.4)
  Top 0.305: 17.48,7.08 L12.1
  Top 0.406: X1.4 65.02,15.75 65.28,15.49 v65.28,13.72 | C16.1 47.12,11.12 IC9.5 44.85,11.67 44.2,12.32 44.2,12.7 | 44.2,12.7 44.2,15.24 | 44.2,15.24 44.2,17.65 44.96,18.41 46.1,18.41 | 46.1,18.41 47.78,18.41 IC10.5 | IC8.5 44.26,15.3 44.2,15.24 | T2.2 46.61,29.72 v47.5,28.83 | v46.1,20.57 46.1,18.41 | 44.2,12.7 v43.87,12.7 | v22.73,8.64 17.93,8.64 17.48,8.18 17.48,7.08
  Top 0.813: 5.59,12.19 5.59,11.73 IC2.4 | C16.1 47.62,9.65 v53.34,9.65
  Bottom 0.406: v65.28,13.72 65.28,12.45 64.26,11.43 55.12,11.43 v53.34,9.65 | v47.5,28.83 46.48,27.81 46.48,24.13 46.1,23.75 v46.1,20.57 | v22.73,8.64 23.88,9.78 37.85,9.78 39.62,8 41.02,8 43.87,10.85 v43.87,12.7
  other vias: 2.41,17.53 6.35,17.53 10.41,17.53 4.32,15.49 8.38,15.49 15.24,15.49 7.62,10.16 4.32,7.87 7.62,7.87 12.45,7.24 6.35,5.84 10.41,5.84 14.22,5.97 4.32,3.81 8.38,3.81 15.88,7.37 2.29,5.84 6.35,1.78 10.41,1.78 2.29,1.78 17.27,1.91 1.91,11.18
  pour Top: 0.25,19.3 16.38,19.3 16.38,8.38 18.41,8.38 18.41,0.38 17.91,0.38 0.51,0.51
  pour Bottom: 0,18.8 18.29,18.8 18.29,0.51 0.51,0.51
+3V3A  (via drill 0.61)
  Top 0.254: C41.1 33.4,13.87 33.4,14.73 33.89,15.22 IC6.21 33.89,17.76 | 30.61,16.26 30.89,16.54 IC6.15 30.89,17.65 | IC6.17 31.89,17.77 31.88,17.78 | 29.08,22.61 IC6.4 26.71,22.61 C40.1 | IC6.11 27.87,19.11 27.69,19.05 | RN11.2 19.7,40.49 19.28,40.87 19.28,43.03 19.68,43.43 R24.1
  Top 0.305: 31.88,17.78 31.88,18.29 | 31.88,18.29 31.11,18.29 | 30.89,17.65 30.89,18.06 31.11,18.29 | 33.89,17.76 33.89,18.05 33.66,18.29 31.88,18.29 | 31.11,18.29 31.11,18.54 30.61,19.05 29.59,19.05 29.46,19.18 29.46,19.3 | 29.08,22.61 29.46,22.23 29.46,20.57 | 29.46,20.57 29.46,19.3 | IC6.11 29.27,19.11 29.46,19.3 | 29.46,20.57 29.43,20.61 IC6.8 27.52,20.61 27.18,20.95 23.24,20.95 22.89,20.6 C39.1 | 30.61,16.26 29.62,15.27 C43.1
  Top 0.406: C45.1 26.47,17.58 27.3,18.41 27.3,18.8 27.56,19.05 27.69,19.05 | C38.+ | v25.4,31.11 25.4,33.15 19.95,38.59 RN11.1 RN11.2
  Top 0.61: L12.2 20.52,7.06 C38.+ C44.+ 25.02,5.56 25.02,13.46 26.34,14.78 C42.1 C45.1 26.77,17.14 v28.32,17.14
  Bottom 0.61: v25.4,31.11 25.4,20.07 v28.32,17.14
+3V3D  (via drill 0.61)
  Top 0.254: IC6.28 37.8,20.11 38.35,19.56 38.35,18.03 39.12,17.27 C18.2
  Top 0.305: R9.2 33.02,31.37 R12.2 | R10.2 33.05,30.07 R9.2 | 38.86,31.88 37.21,33.53 34.67,33.53 33.27,32.13 R9.2 | 38.86,31.88 39.75,31.88 | 39.75,31.88 40.39,31.88 | RN8.6 39.74,31.87 39.75,31.88 | RN8.7 38.95,31.79 38.86,31.88 | 40.39,31.88 40.57,32.06 arc45 40.64,32.24 v40.64,32.64 | 40.39,31.88 40.47,31.79 arc-45 40.55,31.61 RN8.5
  Top 0.406: 39.62,17.09 C18.2
  Top 0.61: C18.2 39.37,17.14 v38.48,16.26 39.24,15.49 C37.+ C17.+ | L2.2 19.69,4.44 v20.07,4.06
  Bottom 0.406: v38.48,16.26 38.48,18.03 34.16,22.35 34.16,24.13 35.43,25.4 39.24,25.4 40.64,26.8 v40.64,32.64
  Bottom 0.61: v38.48,16.26 38.48,14.99 34.67,11.18 22.35,11.18 20.07,8.89 v20.07,4.06
+5V  (via drill 0.61, 0.81)
  Top 0.254: 7.01,26.54 IC4.5
  Top 0.305: v1.4,24.64 4.06,24.64 RN13.1 6,26.58 IC4.5
  Top 0.406: IC1.4 43.9,28.49 v44.32,28.07
  Top 0.813: A2.3 C11.1 D5.3 C4.1 D6.3 38.48,45.34 C1.1 | C5.+ 10.72,14.39 IC2.3 10.69,13.46 v7.64,13.46 | C12.1 A3.3 | POWER.5 38.1,5.08 38.99,5.97 49.53,5.97 v50.04,6.48 | C2.1 27.25,39.37 TWI2.2 | C6.1 34.87,39.37 TWI1.2
  Bottom 0.305: D5.3 45.47,44.45 44.83,43.81 44.83,28.57 v44.32,28.07
  Bottom 0.406: v1.4,24.64 0.89,24.13 0.89,15.37 1.91,14.35 6.76,14.35 v7.64,13.46 | 63.37,32.26 63.63,32
  Bottom 0.813: ICSP.2 65.91,30.48 64.39,32 63.63,32 61.98,32 60.71,30.73 60.71,26.16 53.59,19.05 53.59,12.45 50.04,8.76 v50.04,6.48 | 63.37,32.26 63.37,36.45 64.77,37.85 64.77,43.56 63.88,44.45 A3.3 A2.3 | TWI2.2 TWI1.2 33.4,39.37 38.48,44.45 D6.3 | v7.64,13.46 16.51,13.46 17.53,12.45 17.53,4.32 19.56,2.29 24.26,2.29 27.56,5.59 37.08,5.59 38.1,4.57 POWER.5
A2
  Bottom 0.406: JANALOG.3 55.88,2.79 54.36,4.32 48.01,4.32 47.12,5.21 47.12,9.14 50.8,12.83 50.8,19.94 57.28,26.42 57.28,40.89 56.26,41.91 A2.2
A3
  Bottom 0.406: JANALOG.4 58.42,3.3 56.64,5.08 48.39,5.08 47.88,5.59 47.88,8.76 51.69,12.57 51.69,19.68 58.67,26.67 58.67,40.89 59.69,41.91 A3.2
ACT  (via drill 0.61)
  Top 0.305: IC6.27 36.14,19.61 35.43,20.32 v34.54,20.32 | 57.4,30.86 ACT.C 57.14,31.24 56.77,31.24 56.13,31.88 50.16,31.88 46.99,35.05 38.1,35.05 v37.97,35.18
  Bottom 0.305: v34.54,20.32 33.27,21.59 33.27,30.48 v37.97,35.18
AREF
  Bottom 0.305: JHIGH.8 23.88,51.18 24,51.31 24,50.93 JHIGH.8
D4/SD_CS  (via drill 0.61)
  Top 0.406: IC10.2 51.44,19.05 53.59,21.21 v53.59,24.51
  Bottom 0.406: v53.59,24.51 54.23,24.51 56.26,26.54 56.26,32.13 51.44,36.96 51.44,46.74 53.34,48.64 JLOW.5
D5
  Bottom 0.406: JLOW.6 50.8,48.39 49.78,47.37 49.78,42.42 49.28,41.91 D5.2
D6  (via drill 0.61)
  Top 0.305: D6.2 40.64,41.91 42.16,40.39 v43.18,40.39
  Bottom 0.406: JLOW.7 48.26,49.02 43.43,44.2 43.18,43.94 v43.18,40.39
FDXLED  (via drill 0.61)
  Top 0.305: IC6.26 35.37,19.11 v35.18,18.92 | 57.5,32.31 57.55,32.36 FDX1.C 57.22,32.69 50.49,32.69 47.5,35.69 40.64,35.69 40.01,36.32 37.69,36.32 v36.55,35.18
  Bottom 0.305: v35.18,18.92 34.29,18.92 32.64,20.57 32.64,31.27 v36.55,35.18
GND  (via drill 0.61)
  Top 0.254: 27.18,23.24 27.3,23.11 | IC6.3 | IC6.9 27.13,20.11 27.05,20.19
  Top 0.305: C40.2 25.98,24.94 27.05,23.88 27.05,23.37 27.18,23.24 | 27.05,20.19 26.92,20.32 24.51,20.32 24.51,19.41 | 24.51,19.41 R8.1 | 24.51,19.41 24.51,19.3 24,18.8 22.43,18.8 C39.2 | IC6.29 36.16,20.61 35.43,21.34 35.18,21.21 33.15,23.24 v30.2,23.11 31.16,23.19 arc-45 30.98,23.11 IC6.3 | C7.2 41.33,17.65 | 41.33,17.65 41.33,17.17 C18.1 | 41.58,17.91 41.33,17.65 | IC6.3 27.31,23.11 arc-45 27.3,23.11 | IC6.14 30.39,17.89 arc45 30.32,18.07 30.1,18.29 | IC6.16 31.39,16.28 31.66,16 32.38,16 32.89,16.51 IC6.19
  Top 0.406: 63.37,10.23 X1.GND2 | ON.C L.C
  Top 1.016: 19.05,11.16 C8.- | IC2.1 16.87,8.87 18.8,10.79 18.8,10.94 C8.- | 18.29,11.18 C8.-
  Bottom 0.406: POWER.6 POWER.7
  other vias: 60.96,9.7 29.01,6.91 54.51,26.39 66.17,17.91 48.26,2.54 35.33,45.64 49.66,39.5 44.09,24.21 47.14,22.48 43.69,51.05 28.96,25.86 49.35,29.26 36.83,32.38 61.34,15.75 61.37,13.54 20.55,15.7 6.25,25.25 11.56,49.76 4.72,30.2 52.5,38.46 42.57,16 5.66,46.89 21.51,38.71 40.46,15.93 26.72,36.8 34.34,37.82 59.99,38.71
  pour Top (isolate 0.305, rank 2): 16.64,20.83 18.41,24.77 -0.38,24.74 -0.38,30.73 18.67,30.73 18.41,37.34 17.27,37.34 17.4,46.35 0.64,46.35 0.64,53.34 64.39,53.34 65.53,51.56 65.53,40.13 68.07,37.59 68.07,5.59 65.53,3.05 65.53,1.51 arc-90 64.53,0.51 16.64,0.38
  pour Bottom (isolate 0.305, rank 2): 17.65,46.35 0.38,46.35 0.51,53.21 64.26,53.34 65.53,51.56 65.53,40.13 68.07,37.59 68.07,5.59 65.53,3.05 65.53,1.51 arc-90 64.53,0.51 18.29,0.51 18.41,20.95 18.41,24.39 18.16,24.39 0.25,24.38 0.13,30.61 18.41,30.61 18.41,37.47 17.78,37.47
INT
  Top 0.254: RN8.4 40.55,27.84 38.61,25.91 37.47,25.91 36.96,25.4 36.96,24.15 IC6.36
IO10*/SS  (via drill 0.61)
  Top 0.254: RN8.3 39.74,28.57 v38.1,26.92 37.34,26.92 36.2,25.78 36.2,25.27 34.42,23.5 34.42,22.86 35.18,22.1 36.9,22.1 IC6.32
  Top 0.305: v36.58,39.62 JHIGH.3
  Bottom 0.305: v38.1,26.92 38.35,27.18 38.35,33.15 39.24,34.04 39.24,35.56 36.58,38.23 v36.58,39.62
IO13*  (via drill 0.61)
  Top 0.305: IC4.2 8.2,27.23 8,27.43 8,28.57 v7.37,29.21 | v26.8,32.89 29.21,35.31 29.21,50.55 JHIGH.6
  Bottom 0.305: v7.37,29.21 8.26,29.21 9.78,27.69 19.18,27.69 24.38,32.89 v26.8,32.89
LINKLED  (via drill 0.61)
  Top 0.254: T2.3 46.02,33.02 44.88,34.16 36.12,34.16 v35.13,35.15
  Top 0.305: LINK1.C 57.62,33.78 57.45,33.96 | 57.5,33.78 LINK1.C | IC6.25 36.91,17.61 v36.63,17.32 | v35.13,35.15 36.93,36.96 40.39,36.96 41.02,36.32 47.88,36.32 50.55,33.66 57.12,33.66 LINK1.C
  Bottom 0.254: 35.03,35.05 21.46,35.05 17.4,39.12 17.4,41.91 16.51,42.8 14.73,42.8 13.59,41.66 7.75,41.66
  Bottom 0.305: UC1.L4 2.69,44.68 5.71,41.66 7.75,41.66 | v36.63,17.32 36.17,17.78 34.42,17.78 32,20.19 32,32.03 v35.13,35.15 35.03,35.05
MISO  (via drill 0.61)
  Top 0.254: IC6.34 v35.43,23.11
  Top 0.305: 62.99,12.45 X1.7 65.66,12.45 66.29,13.08 66.29,15.88 65.15,17.02 65.15,24 64.9,24.26 64.9,29.21 ICSP.1 | 63,12.45 62.99,12.45 | v40.64,9.27 44.07,9.27 45.21,8.13 57.28,8.13 61.59,12.45 62.99,12.45
  Bottom 0.305: v35.43,23.11 41.53,17.02 41.53,10.16 v40.64,9.27
MOSI  (via drill 0.61)
  Top 0.305: IC8.2 50.22,15.95 51.56,14.61 56.48,14.61 v57.02,15.15
  Bottom 0.305: v57.02,15.15 57.02,17.4 62.23,22.61 62.23,26.04 62.87,26.67 64.9,26.67 ICSP.4
MOSI3  (via drill 0.61)
  Top 0.254: v38.35,24.13 37.85,23.75 37.72,23.62 36.92,23.62 IC6.35
  Top 0.305: X1.3 55.89,16.85 54.91,15.88 52.15,15.88 50.8,17.22 48.21,17.22 47.88,16.89 47.88,16.82 IC8.4 46.01,16.6 v45.26,16.59
  Bottom 0.305: 38.61,24.13 v38.35,24.13 38.73,24.13 39.37,23.5 39.37,22.48 v45.26,16.59
N$1
  Top 0.406: 12.32,26.42 12.4,26.42 | 12.36,26.67 L7.2 11.72,25.86 10.62,25.86 9.78,25.02 7.75,25.02 6.6,23.88 3.68,23.88 2.54,22.73 2.26,22.48 arc45 2.08,22.41 ZZ1.P$1
  Top 0.61: 12.4,26.42 L7.2
N$2
  Top 0.406: ZZ1.P$2 6.39,20.83 17.53,20.83 18.41,21.72 L8.2
N$3
  Top 0.406: ZZ1.P$4 10.06,22.88 11.56,24.38 14.22,24.38 15.24,25.4 15.96,25.4 L9.2
N$4
  Top 0.406: L10.2 13.97,25.91 13.21,25.15 11.05,25.15 10.16,24.26 8.38,24.26 7.23,23.1 ZZ1.P$3
N$9
  Top 0.254: IC6.31 38.73,21.61 R3.1 | R3.1 40.95,22.5 Q2.1 | C3.1 R3.1
N$13
  Top 0.254: IC6.39 34.39,26.52 36.91,29.04 RN9.4
N$14
  Top 0.305: 59.56,30.84 ACT.A 60.07,30.41 60.07,29.21 59.72,28.86 RN3.8
N$15
  Top 0.254: Q2.2 41.19,20.28 41.38,20.28 R13.2 42.44,19.02
N$16
  Top 0.254: R21.1 44.31,22.86 43.11,22.86 Q2.4
N$22  (via drill 0.61)
  Top 0.305: v40.39,48.9 42.55,46.74 57.15,46.74 57.91,45.97 57.91,37.34 58.62,36.63 58.62,34.65 59.41,33.86 LINK1.A 60.66,33.86 61.34,33.17 61.34,28.19 60.41,27.26 RN3.6
  Bottom 0.254: 2.67,48.26 0.51,46.1 0.51,42.93 1.27,42.16 3.17,42.16
  Bottom 0.305: v40.39,48.9 40.13,48.9 39.62,48.39 18.41,48.39 17.78,49.02 17.02,49.02 16.26,48.26 2.67,48.26 | 3.17,42.16 UC1.L3
N$24
  Top 0.254: IC6.23 34.89,15.66 36.65,13.89 R4.2
N$25  (via drill 0.61)
  Top 0.305: UC1.L1 3.19,33.42 9.4,39.62 9.4,43.05 12.45,46.1 15.62,46.1 v17.27,47.75 | v43.56,49.15 45.34,47.37 57.4,47.37 58.67,46.1 58.67,37.47 59.69,36.45 59.69,35.42 100M1.A 59.67,35.36 60.86,35.36 61.98,34.24 61.98,27.56 60.83,26.42 59.32,26.42 RN3.5
  Bottom 0.305: v43.56,49.15 43.43,49.15 42.04,47.75 v17.27,47.75
N$26
  Top 0.305: C19.2 R23.1 R22.1
  Top 0.406: 22,25.5 R22.1
N$27
  Top 0.254: 16.41,31.04 19,31.04 19.56,30.48 19.56,23.24 19.94,22.86 21.21,22.86 C27.2
  Top 0.305: UC1.R1 14.99,44.07 14.86,44.2 12.45,44.2 10.67,42.42 10.67,35.05 11.81,33.91 13.46,33.91 16.41,31.04
N$28
  Top 0.305: UC1.R2 11.3,41.19 11.3,36.96 11.81,36.45 13.59,36.45 14.86,35.18 16.76,35.18 17.27,34.67 C28.2
N$30
  Top 0.305: FDX1.A 60.25,32.33 60.71,31.88 60.71,28.7 60.06,28.06 RN3.7
N$31
  Top 0.254: IC6.40 33.91,25.66 33.91,26.8 36.11,29 RN9.3
N$32
  Top 0.406: R6.1 13.51,21.97 ZZ1.P$5
N$33
  Top 0.406: R6.2 15.34,23.75 ZZ1.P$6
N$34
  Top 0.406: ZZ1.P$9 50.3,23.58 R5.2 R7.1
N$35
  Top 0.254: IC6.41 33.4,25.65 33.4,27.05 35.31,28.96 RN9.2
N$36
  Top 0.305: C31.2 R24.2 17.36,43.43 UC1.R3
N$37
  Top 0.254: IC6.42 32.89,27.3 34.51,28.92 RN9.1
N$38
  Top 0.254: IC6.20 33.39,16.17 C46.+
N$39
  Top 0.254: IC6.38 34.89,26.25 37.34,28.7 37.72,28.7 38.1,29.08 38.1,29.81 RN8.1
N$40
  Top 0.305: IC6.10 26.6,19.61 R8.2
N$41
  Top 0.254: ON.A RN13.8
N$42
  Top 0.254: RN13.2 6.63,27.34 IC4.4
N$43
  Top 0.254: L.A 3.18,28.31 4.06,27.43 4.51,27.43 RN13.7
OSC2E2
  Top 0.254: IC6.30 38.96,21.11 39.24,20.83 39.52,20.83 R3.2 39.75,20.83 40.51,21.59 41.84,21.59 Q2.3
  Top 0.305: R3.2 39.75,18.85 C7.1
PMODE0
  Top 0.254: IC6.45 31.39,26.4 30.99,26.8 29.46,26.8 28.96,27.3 28.96,31.39 29.26,31.7 R11.2
  Top 0.305: R11.2 R9.1
PMODE1
  Top 0.254: 31.37,28.47 31.37,27.43 31.89,26.91 IC6.44 | R15.2 R12.1
  Top 0.305: 31.29,28.5 R12.1 31.37,28.47
PMODE2
  Top 0.254: 31.42,30.3 32,29.84 32,27.81 32.39,27.43 IC6.43 | R20.2 R10.1
  Top 0.305: 30.86,30.1 31.22,30.1 R10.1 31.42,30.3
RESET  (via drill 0.61)
  Top 0.305: RESET.3 3.97,47.53 4.45,48.01 10.84,48.01 RESET.4 11.86,47.24 v14.22,47.24 | IC1.3 42,27.98 v42.74,26.99 46.55,26.99 46.99,27.43 54.99,27.43 55.75,26.67 55.75,25.91 59.44,22.23 61.21,22.23 63.63,24.64 ICSP.5 | POWER.3 33.02,7.26 33.5,7.75 v43.05,7.75
  Bottom 0.305: v42.74,26.99 42.74,21.02 46.48,17.27 46.48,12.57 43.05,9.14 v43.05,7.75 | 40.64,47.12 18.16,47.12 17.65,46.61 14.86,46.61 v14.22,47.24
  Bottom 0.406: 40.64,47.12 41.66,46.1 41.66,33.78 42.67,32.77 42.67,27.05 v42.74,26.99
RESET_W
  Top 0.254: IC6.37 35.39,25.86 37.47,27.94 38.1,27.94 38.99,28.83 38.99,29.81 RN8.2 38.95,30.26 39.22,30.53 41.02,30.53 41.71,31.22 41.71,31.46 IC1.2 41.99,31.74
RXIN
  Top 0.254: IC6.5 25.01,22.11 24.64,22.48 24.64,24.77 24.13,25.27 R22.2 22.63,26.42 20.95,26.42 20.07,27.3 20.07,30.73 19.3,31.5 19.3,33.53 19.56,33.78 C28.1
RXIP
  Top 0.254: IC6.6 24.11,21.61 C27.1 23.77,22.33 R23.2
SCK  (via drill 0.61)
  Top 0.305: v60.71,23.22 62.23,24.74 62.23,25.78 62.61,26.16 62.61,27.05 63.5,27.94 ICSP.3 | IC9.2 49.91,12.32 51.56,13.97 54.48,13.97 v55.37,13.08
  Bottom 0.305: v55.37,13.08 55.37,17.88 v60.71,23.22
SCK3  (via drill 0.61)
  Top 0.254: v38.23,22.61 IC6.33
  Top 0.305: 62.91,14.65 X1.5 63.45,14.61 59.69,14.61 55.75,10.67 48.9,10.67 48.51,11.05 48.51,11.94 47.66,12.79 IC9.4 47.62,13.01 46.05,13.01 v45.26,13.01
  Bottom 0.305: v38.23,22.61 43.56,17.27 43.56,16.64 45.26,14.94 v45.26,13.01
SCL
  Top 0.305: JHIGH.10 18.8,51.69 19.56,52.45 22.23,52.45 22.61,52.07 22.61,45.21 23.37,44.45 TWI2.4
  Bottom 0.305: TWI1.4 TWI2.4
SDA
  Top 0.305: JHIGH.9 21.84,50.29 21.84,43.31 23.24,41.91 TWI2.3
  Bottom 0.305: TWI1.3 TWI2.3
SEN3
  Top 0.305: 62.65,17.95 X1.2 56.05,17.95 54.61,16.51 52.4,16.51 51.13,17.78 48.9,17.78 48.64,18.03 48.64,18.67 47.79,19.52 IC10.4
SPDLED  (via drill 0.61)
  Top 0.254: IC6.24 35.39,16.55 v36.32,15.62
  Top 0.305: 57.5,35.43 100M1.C 57.22,35.05 56.9,35.05 56.39,34.54 50.67,34.54 48.26,36.96 41.78,36.96 41.02,37.72 36.2,37.72 31.62,33.15 v30.48,33.15 30.73,33.15
  Bottom 0.305: v36.32,15.62 35.69,17.02 34.04,17.02 31.37,19.68 31.37,32.26 v30.48,33.15 29.21,34.42 20.95,34.42 17.65,37.72 14.86,37.72 13.59,36.45 3.55,36.45 UC1.L2
TXON
  Top 0.305: IC6.1 27.96,24.11 27.3,24.77 27.3,25.91 22.1,31.11 22.1,34.8 19.18,37.72 14.73,37.72 12.91,39.54 UC1.R4 16.51,40.26 16.75,40.49 RN11.7
TXOP
  Top 0.254: IC6.2 29.2,23.61 29.46,23.88 29.46,24.38 29.08,24.77
  Top 0.305: 18.67,38.99 UC1.R5 | 29.08,24.77 28.32,24.77 27.94,25.15 27.94,26.16 22.86,31.24 22.86,34.8 18.67,38.99 | RN11.8 18.6,39.05 18.67,38.99
V1+
  Top 0.305: C20.2 10.8,28.53 L7.1
  Top 0.406: L7.1 12.45,32.13 12.91,32.6 UC1.R10
V1-  (via drill 0.61)
  Top 0.254: UC1.R9 15.45,33.59 16.99,32.05 C21.2
  Top 0.406: L8.1 18.54,28.53 v18.54,29.97
  Bottom 0.406: UC1.R9 15.45,33.57 18.54,30.48 v18.54,29.97
V2+  (via drill 0.61)
  Top 0.305: UC1.R7 16.89,36.45 C29.2
  Top 0.406: v16.89,29.97 L9.1
  Bottom 0.406: UC1.R7 13.97,34.16 13.97,33.53 16.89,30.61 v16.89,29.97
V2-  (via drill 0.61)
  Top 0.406: L10.1 v13.97,29.97 | 14.01,28.45 L10.1 | C26.2 L10.1
  Bottom 0.406: v13.97,29.97 13.46,29.97 11.18,32.26 11.18,33.53 12.83,35.18 UC1.R8
VIN  (via drill 0.81)
  Top 0.406: R5.1 50.09,21.67 C10.2 48.39,24.92 ZZ1.P$8
  Top 0.813: v27.41,8.15 27.41,11.16 C9.+
  Bottom 0.813: v27.41,8.15 37.31,8.15 40.13,5.33 45.59,5.33 45.72,5.46
  Bottom 1.016: POWER.8 45.72,5.46 45.72,10.16 48.77,13.21 48.77,24.54 ZZ1.P$8

### Text on the board
Top: LC
Bottom: LS | SHIELD ETH11 V2
tPlace: S P I | Ethernet Shield 2
tNames: TX | RX | AREF | GND | 3 2 1 0 9 8 | 7 6 5 4 3 2 1 0 | 1 1 1 1 | (*=PWM) | * | * | * | * | * | * | Arduino | 1 | arduino.org | ANALOG IN | RES | 3V3 | 5V Gnd 12V | 0 1 2 3 4 5